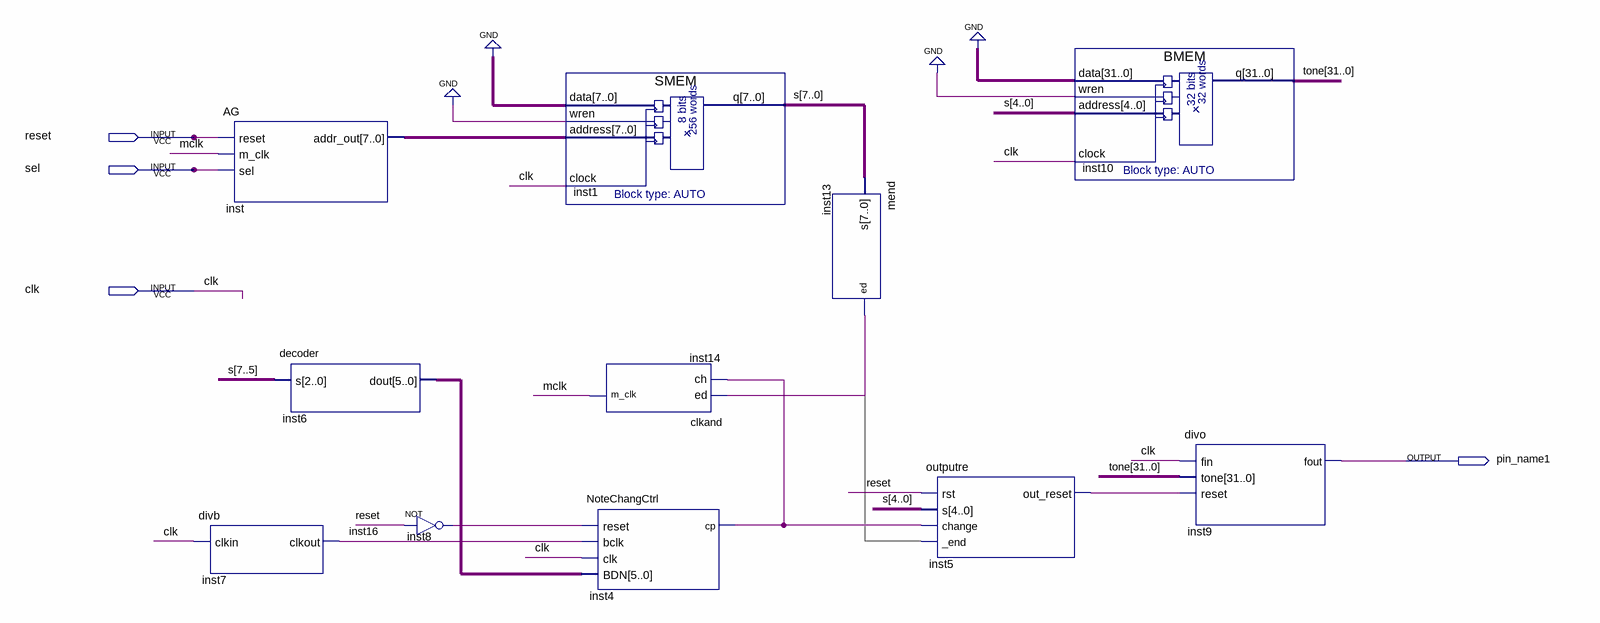
[diagram p0: schematic sheet]
// Quartus schematic week4.bdf as structural Verilog: 11 symbols, 4 pins
module week4 (
  input  reset,
  input  sel,
  input  clk,
  output pin_name1
);

  wire inst4_cp, inst5_out_reset, inst8_out, inst13_ed, inst16, mclk;
  wire [5:0] inst6_dout;
  wire [7:0] inst_addr_out, s;
  wire [31:0] tone;

  AG inst (.reset(reset), .m_clk(mclk), .sel(sel), .addr_out(inst_addr_out));
  divb inst7 (.clkin(clk), .clkout(inst16));
  decoder inst6 (.s(s[7:5]), .dout(inst6_dout));
  not inst8 (inst8_out, reset);
  SMEM inst1 (.data({8{1'b0}}), .wren(1'b0), .address(inst_addr_out), .clock(clk), .q(s));
  clkand inst14 (.ed(inst13_ed), .ch(inst4_cp), .m_clk(mclk));
  NoteChangCtrl inst4 (.reset(inst8_out), .bclk(inst16), .clk(clk), .BDN(inst6_dout), .cp(inst4_cp));
  mend inst13 (.s(s), .ed(inst13_ed));
  outputre inst5 (.rst(reset), .s(s[4:0]), .change(inst4_cp), .out_reset(inst5_out_reset));  // open: _end
  BMEM inst10 (.data({32{1'b0}}), .wren(1'b0), .address(s[4:0]), .clock(clk), .q(tone));
  divo inst9 (.fin(clk), .tone(tone), .reset(inst5_out_reset), .fout(pin_name1));
endmodule
